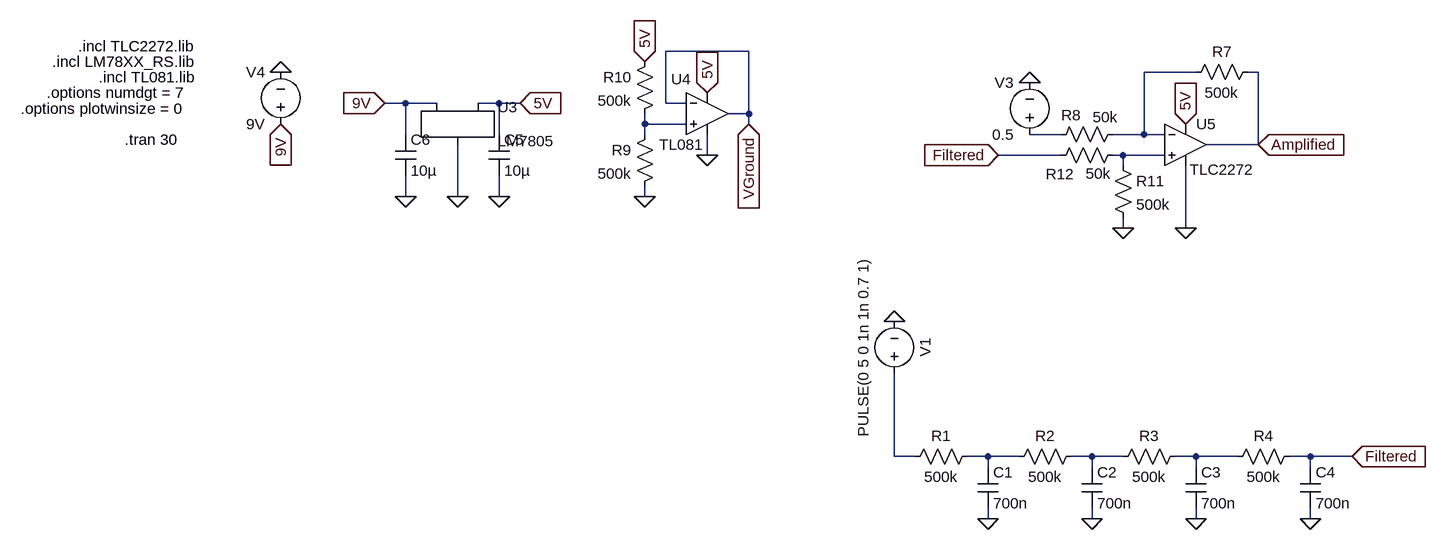
[diagram p0: schematic X_2ndOrderBPF_Schmitt - Copy.asc]
X_2ndOrderBPF_Schmitt - Copy.asc, the LTspice schematic file:
Version 4
SHEET 1 1824 680
WIRE -1088 -1696 -1216 -1696
WIRE -400 -1664 -480 -1664
WIRE -304 -1664 -320 -1664
WIRE -1616 -1616 -1648 -1616
WIRE -1568 -1616 -1616 -1616
WIRE -1472 -1616 -1504 -1616
WIRE -1440 -1616 -1472 -1616
WIRE -1216 -1616 -1216 -1696
WIRE -1184 -1616 -1216 -1616
WIRE -1088 -1600 -1088 -1696
WIRE -1088 -1600 -1120 -1600
WIRE -1248 -1584 -1248 -1600
WIRE -1184 -1584 -1248 -1584
WIRE -1088 -1584 -1088 -1600
WIRE -1616 -1568 -1616 -1616
WIRE -1472 -1568 -1472 -1616
WIRE -1248 -1568 -1248 -1584
WIRE -608 -1568 -656 -1568
WIRE -480 -1568 -480 -1664
WIRE -480 -1568 -528 -1568
WIRE -448 -1568 -480 -1568
WIRE -304 -1552 -304 -1664
WIRE -304 -1552 -384 -1552
WIRE -1152 -1536 -1152 -1568
WIRE -608 -1536 -704 -1536
WIRE -512 -1536 -528 -1536
WIRE -448 -1536 -512 -1536
WIRE -512 -1520 -512 -1536
WIRE -1616 -1472 -1616 -1504
WIRE -1536 -1472 -1536 -1552
WIRE -1472 -1472 -1472 -1504
WIRE -1248 -1472 -1248 -1488
WIRE -512 -1424 -512 -1440
WIRE -416 -1424 -416 -1520
WIRE -864 -1072 -864 -1200
WIRE -832 -1072 -864 -1072
WIRE -720 -1072 -752 -1072
WIRE -672 -1072 -720 -1072
WIRE -560 -1072 -592 -1072
WIRE -512 -1072 -560 -1072
WIRE -400 -1072 -432 -1072
WIRE -336 -1072 -400 -1072
WIRE -224 -1072 -256 -1072
WIRE -160 -1072 -224 -1072
WIRE -720 -1056 -720 -1072
WIRE -560 -1056 -560 -1072
WIRE -400 -1056 -400 -1072
WIRE -224 -1056 -224 -1072
WIRE -720 -976 -720 -992
WIRE -560 -976 -560 -992
WIRE -400 -976 -400 -992
WIRE -224 -976 -224 -992
FLAG -1536 -1472 0
FLAG -1648 -1616 9V
IOPIN -1648 -1616 In
FLAG -1616 -1472 0
FLAG -1472 -1472 0
FLAG -1440 -1616 5V
IOPIN -1440 -1616 In
FLAG -1248 -1472 0
FLAG -1248 -1680 5V
IOPIN -1248 -1680 In
FLAG -1152 -1536 0
FLAG -1152 -1632 5V
IOPIN -1152 -1632 In
FLAG -1088 -1584 VGround
IOPIN -1088 -1584 In
FLAG -416 -1424 0
FLAG -512 -1424 0
FLAG -416 -1584 5V
IOPIN -416 -1584 In
FLAG -304 -1552 Amplified
IOPIN -304 -1552 In
FLAG -656 -1648 0
FLAG -704 -1536 Filtered
IOPIN -704 -1536 In
FLAG -1808 -1664 0
FLAG -1808 -1584 9V
IOPIN -1808 -1584 In
FLAG -720 -976 0
FLAG -560 -976 0
FLAG -400 -976 0
FLAG -864 -1280 0
FLAG -224 -976 0
FLAG -160 -1072 Filtered
IOPIN -160 -1072 In
SYMBOL LM7805 -1536 -1600 R0
SYMATTR InstName U3
SYMBOL cap -1488 -1568 R0
SYMATTR InstName C5
SYMATTR Value 10µ
SYMBOL cap -1632 -1568 R0
SYMATTR InstName C6
SYMATTR Value 10µ
SYMBOL res -1232 -1584 M0
SYMATTR InstName R9
SYMATTR Value 500k
SYMBOL res -1232 -1696 M0
SYMATTR InstName R10
SYMATTR Value 500k
SYMBOL Opamps\\opamp2 -1152 -1664 R0
WINDOW 0 -55 11 Left 2
WINDOW 3 -74 112 Left 2
SYMATTR InstName U4
SYMATTR Value TL081
SYMBOL res -304 -1680 R90
WINDOW 0 0 56 VBottom 2
WINDOW 3 32 56 VTop 2
SYMATTR InstName R7
SYMATTR Value 500k
SYMBOL res -512 -1584 R90
WINDOW 0 2 80 VBottom 2
WINDOW 3 -26 27 VTop 2
SYMATTR InstName R8
SYMATTR Value 50k
SYMBOL Opamps\\opamp2 -416 -1616 R0
WINDOW 3 6 102 Left 2
SYMATTR Value TLC2272
SYMATTR InstName U5
SYMBOL res -528 -1536 R0
SYMATTR InstName R11
SYMATTR Value 500k
SYMBOL res -512 -1552 R90
WINDOW 0 61 97 VBottom 2
WINDOW 3 29 38 VTop 2
SYMATTR InstName R12
SYMATTR Value 50k
SYMBOL voltage -656 -1552 R180
WINDOW 0 24 96 Left 2
WINDOW 3 24 16 Left 2
WINDOW 123 0 0 Left 0
WINDOW 39 0 0 Left 0
SYMATTR InstName V3
SYMATTR Value 0.5
SYMBOL voltage -1808 -1568 R180
WINDOW 0 24 96 Left 2
WINDOW 3 24 16 Left 2
WINDOW 123 0 0 Left 0
WINDOW 39 0 0 Left 0
SYMATTR InstName V4
SYMATTR Value 9V
SYMBOL res -736 -1088 R90
WINDOW 0 0 56 VBottom 2
WINDOW 3 32 56 VTop 2
SYMATTR InstName R1
SYMATTR Value 500k
SYMBOL cap -736 -1056 R0
SYMATTR InstName C1
SYMATTR Value 700n
SYMBOL res -576 -1088 R90
WINDOW 0 0 56 VBottom 2
WINDOW 3 32 56 VTop 2
SYMATTR InstName R2
SYMATTR Value 500k
SYMBOL cap -576 -1056 R0
SYMATTR InstName C2
SYMATTR Value 700n
SYMBOL res -416 -1088 R90
WINDOW 0 0 56 VBottom 2
WINDOW 3 32 56 VTop 2
SYMATTR InstName R3
SYMATTR Value 500k
SYMBOL cap -416 -1056 R0
SYMATTR InstName C3
SYMATTR Value 700n
SYMBOL voltage -864 -1184 R180
WINDOW 0 -32 56 VBottom 2
WINDOW 3 32 56 VTop 2
WINDOW 123 0 0 Left 0
WINDOW 39 0 0 Left 0
SYMATTR InstName V1
SYMATTR Value PULSE(0 5 0 1n 1n 0.7 1)
SYMBOL res -240 -1088 R90
WINDOW 0 0 56 VBottom 2
WINDOW 3 32 56 VTop 2
SYMATTR InstName R4
SYMATTR Value 500k
SYMBOL cap -240 -1056 R0
SYMATTR InstName C4
SYMATTR Value 700n
TEXT -2048 -1560 Left 2 !.tran 30
TEXT -2120 -1704 Left 2 !.incl TLC2272.lib
TEXT -2160 -1680 Left 2 !.incl LM78XX_RS.lib
TEXT -2088 -1656 Left 2 !.incl TL081.lib
TEXT -2168 -1632 Left 2 !.options numdgt = 7
TEXT -2208 -1608 Left 2 !.options plotwinsize = 0

The netlist it stands for:
* X_2ndOrderBPF_Schmitt - Copy.asc
XU3 9V 0 5V LM7805
C5 5V 0 10µ
C6 9V 0 10µ
R9 N002 0 500k
R10 5V N002 500k
XU4 N002 VGround 5V 0 VGround TL081  ; pins In+ In- V+ V- OUT
R7 Amplified N001 500k
R8 N001 N003 50k
XU5 N004 N001 5V 0 Amplified TLC2272  ; pins In+ In- V+ V- OUT
R11 N004 0 500k
R12 N004 Filtered 50k
V3 N003 0 0.5
V4 9V 0 9V
R1 N006 N005 500k
C1 N006 0 700n
R2 N007 N006 500k
C2 N007 0 700n
R3 N008 N007 500k
C3 N008 0 700n
V1 N005 0 PULSE(0 5 0 1n 1n 0.7 1)
R4 Filtered N008 500k
C4 Filtered 0 700n
.tran 30
.incl TLC2272.lib
.incl LM78XX_RS.lib
.incl TL081.lib
.options numdgt = 7
.options plotwinsize = 0
.backanno
.end